# Altium schematic sheet ADF4351原理图(改).SchDoc
size C; Organization: Altium Limited; Address1: L3, 12a Rodborough Rd; Address2: Frenchs Forest; Address3: NSW; Address4: Australia 2086
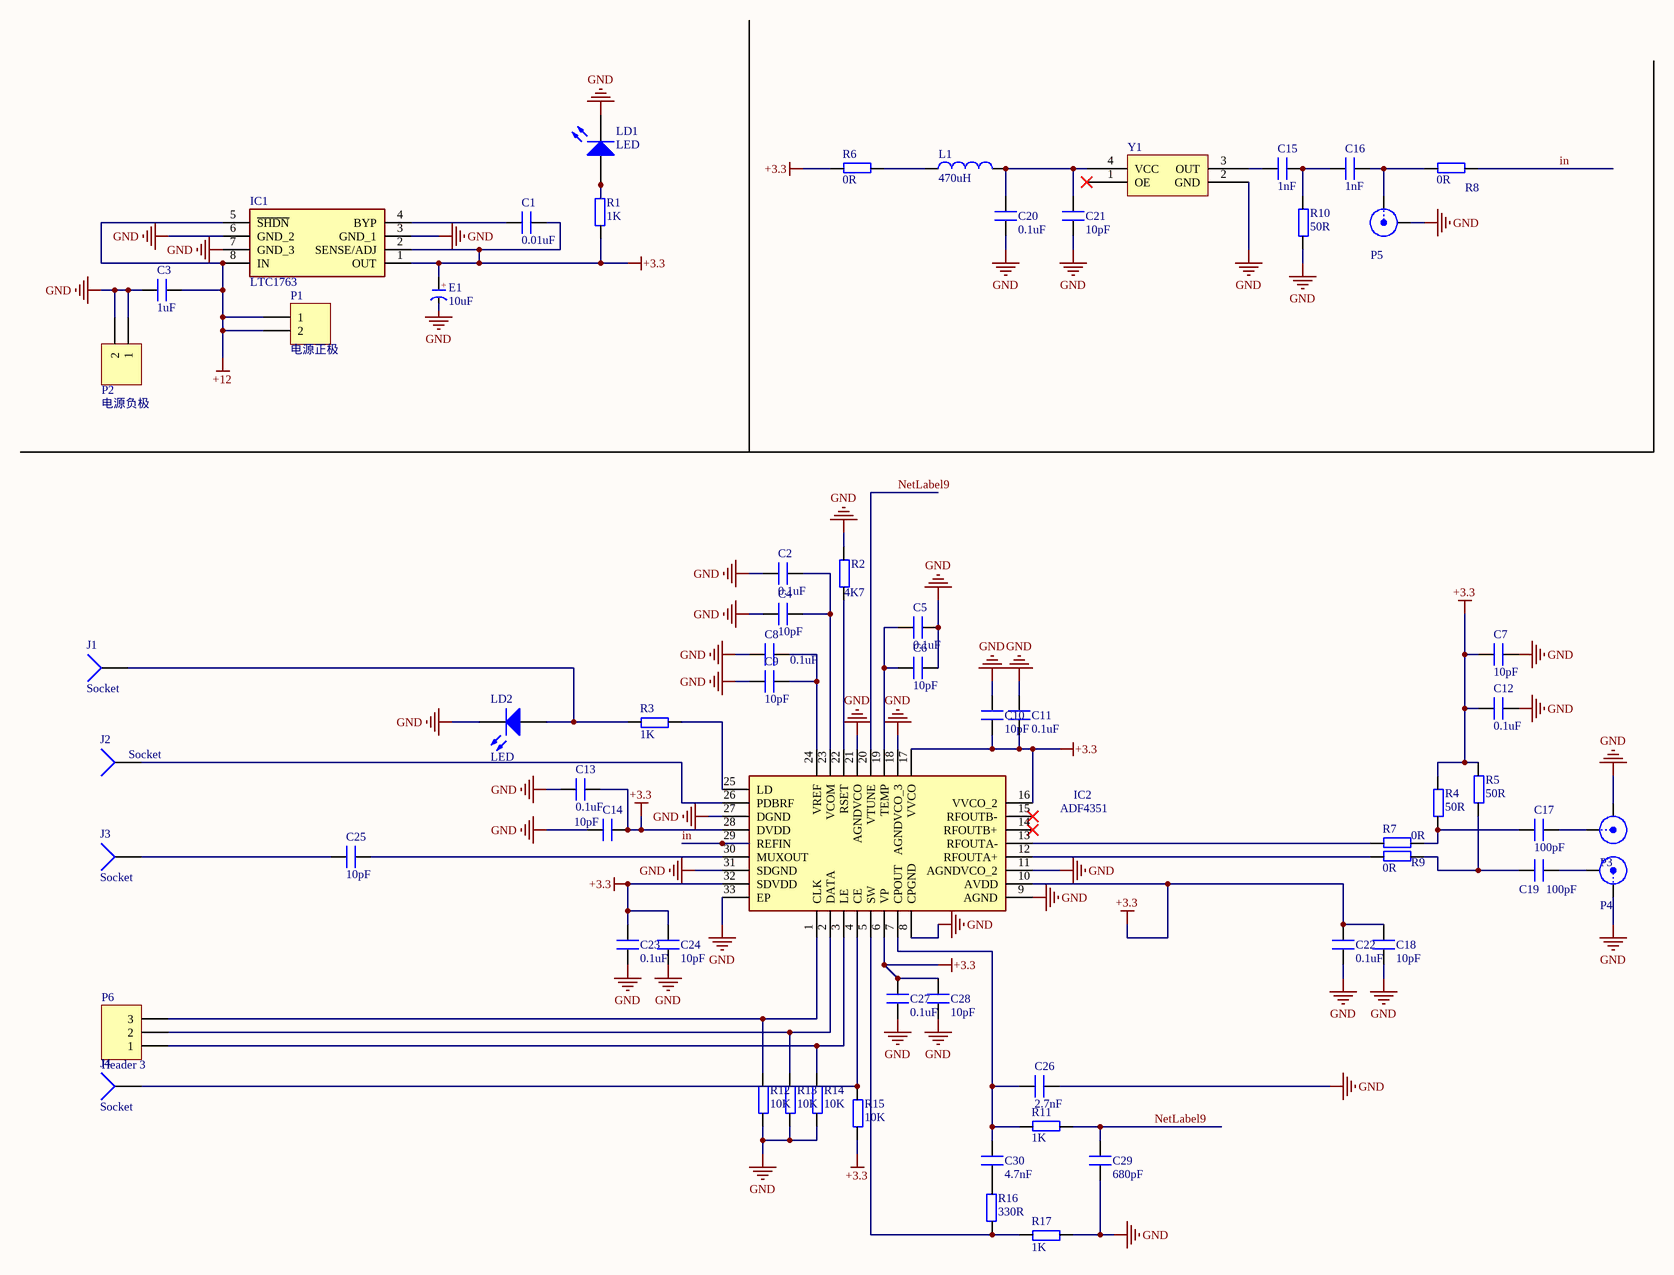
[diagram p0: ADF4351原理图(改).SchDoc]

## Parts
C1  0.01uF  [0603C]
C2  0.1uF  [0603C]
C3  1uF  [0603C]
C4  10pF  [0603C]
C5  0.1uF  [0603C]
C6  10pF  [0603C]
C7  10pF  [0603C]
C8  0.1uF  [0603C]
C9  10pF  [0603C]
C10  10pF  [0603C]
C11  0.1uF  [0603C]
C12  0.1uF  [0603C]
C13  0.1uF  [0603C]
C14  10pF  [0603C]
C15  1nF  [0603C]
C16  1nF  [0603C]
C17  100pF  [0603C]
C18  10pF  [0603C]
C19  100pF  [0603C]
C20  0.1uF  [0603C]
C21  10pF  [0603C]
C22  0.1uF  [0603C]
C23  0.1uF  [0603C]
C24  10pF  [0603C]
C25  10pF  [0603C]
C26  2.7nF  [0603C]
C27  0.1uF  [0603C]
C28  10pF  [0603C]
C29  680pF  [0603C]
C30  4.7nF  [0603C]
E1  10uF  [CAP 1.5*4*8]
IC1  LTC1763  [SOIC8_1R27_4R9X6]
IC2  ADF4351  [QFN50P500X500X100-33N]
J1  Socket  [PIN1]
J2  Socket  [PIN1]
J3  Socket  [PIN1]
J4  Socket  [PIN1]
L1  470uH  [0603C]
LD1  LED  [SMDLED]
LD2  LED  [SMDLED]
P1  电源正极  [HDR1X2]
P2  电源负极  [HDR1X2]
P3  SMA  [SMA-V]  (value not drawn)
P4  SMA  [SMA-V]  (value not drawn)
P5  SMA  [SMA-V]  (value not drawn)
P6  Header 3  [HDR1X3]
R1  1K  [RS 1/4W]
R2  4K7  [0603R]
R3  1K  [0603R]
R4  50R  [0603R]
R5  50R  [0603R]
R6  0R  [0603R]
R7  0R  [0603R]
R8  0R  [0603R]
R9  0R  [0603R]
R10  50R  [0603R]
R11  1K  [0603R]
R12  10K  [0603R]
R13  10K  [0603R]
R14  10K  [0603R]
R15  10K  [0603R]
R16  330R  [0603R]
R17  1K  [0603R]
Y1  (no value)  [XTAL-OCX7050]

## Nets
+3.3: C1.2 C7.1 C10.1 C11.1 C12.1 C13.1 C14.1 C18.1 C22.1 C23.1 C24.1 C27.1 C28.1 E1.1(A) IC1.1(OUT) IC1.2(SENSE/ADJ) IC2.6(VP) IC2.10(AVDD) IC2.16(VVCO_2) IC2.17(VVCO) IC2.28(DVDD) IC2.32(SDVDD) R1.2 R4.2 R5.2 R6.2 R15.1
+12: C3.2 IC1.5(~{SHDN}) IC1.8(IN) P1.1 P1.2
GND: C2.2 C3.1 C4.2 C5.1 C6.1 C7.2 C8.2 C9.2 C10.2 C11.2 C12.2 C13.2 C14.2 C18.2 C20.2 C21.2 C22.2 C23.2 C24.2 C26.2 C27.2 C28.2 C29.2 E1.2(K) IC1.3(GND_1) IC1.6(GND_2) IC1.7(GND_3) IC2.8(CPGND) IC2.9(AGND) IC2.11(AGNDVCO_2) IC2.18(AGNDVCO_3) IC2.21(AGNDVCO) IC2.27(DGND) IC2.31(SDGND) IC2.33(EP) LD1.2(K) LD2.2(K) P2.1 P2.2 P3.2(Y) P4.1(X) P5.2(Y) R2.2 R10.1 R12.1 R13.1 R14.1 R17.2 Y1.2(GND)
in: IC2.29(REFIN) R8.1
NetLabel9: C29.1 IC2.20(VTUNE) R11.1
NetC1_1: C1.1 IC1.4(BYP)
NetC2_1: C2.1 C4.1 IC2.23(VCOM)
NetC5_2: C5.2 C6.2 IC2.19(TEMP)
NetC8_1: C8.1 C9.1 IC2.24(VREF)
NetC15_1: C15.1 C16.2 R10.2
NetC15_2: C15.2 Y1.3(OUT)
NetC16_1: C16.1 P5.1(X) R8.2
NetC17_1: C17.1 R4.1 R7.1
NetC17_2: C17.2 P3.1(X)
NetC19_1: C19.1 R5.1 R9.1
NetC19_2: C19.2 P4.2(Y)
NetC20_1: C20.1 C21.1 L1.2 Y1.4(VCC)
NetC25_1: C25.1 J3.1
NetC25_2: C25.2 IC2.30(MUXOUT)
NetC26_1: C26.1 C30.2 IC2.7(CPOUT) R11.2
NetC30_1: C30.1 R16.1
NetIC2_1: IC2.1(CLK) P6.3 R12.2
NetIC2_2: IC2.2(DATA) P6.2 R13.2
NetIC2_3: IC2.3(LE) P6.1 R14.2
NetIC2_4: IC2.4(CE) J4.1 R15.2
NetIC2_5: IC2.5(SW) R16.2 R17.1
NetIC2_12: IC2.12(RFOUTA+) R9.2
NetIC2_13: IC2.13(RFOUTA-) R7.2
NetIC2_22: IC2.22(RSET) R2.1
NetIC2_25: IC2.25(LD) R3.2
NetIC2_26: IC2.26(PDBRF) J2.1
NetJ1_1: J1.1 LD2.1(A) R3.1
NetL1_1: L1.1 R6.1
NetLD1_1: LD1.1(A) R1.1

Not connected (* = marked no-connect by the designer): IC2 14(RFOUTB+)* 15(RFOUTB-)*; Y1 1(OE)*

## Notes on the sheet
- Title
- Size:
- Date:
- File:
- C
- Number:
- Time:
- Revision:
- Sheet
- of
- (in symbol C-CAP) +

## Library data of the parts
C1-C30 = C: Capacitor
E1 = C-CAP: 直插电解电容; 版权归属: 源创客; BOM名称: 直插电解电容; 学习资源: www.ooocke.com
IC1 = LTC1763CS8-3.3#TRPBF: Integrated Circuit; Manufacturer_Name: Analog Devices; Datasheet Link: https://datasheet.lcsc.com/szlcsc/2004261932_Analog-Devices-ADI-LTC1763CS8-3-3-TRPBF_C515997.pdf; Height: 1.752mm; Manufacturer_Part_Number: LTC1763CS8-3.3#TRPBF; Arrow Part Number: LTC1763CS8-3.3#TRPBF
IC2 = ADF4351BCPZ: Integrated Circuit; Manufacturer_Name: Analog Devices; Datasheet Link: https://componentsearchengine.com//ADF4351BCPZ.pdf; Mouser2 Part Number: 584-ADF4351BCPZ; Mouser2 Price/Stock: https://www.mouser.com/Search/Refine.aspx?Keyword=584-ADF4351BCPZ; Manufacturer_Part_Number: ADF4351BCPZ
L1 = Inductor: Value: 100uH; Published: 8-Jun-2000; Revision: July-2002: Re-released for DXP Platform.; Publisher: Altium Limited
LD1 LD2 = LED: Typical RED, GREEN, YELLOW, AMBER GaAs LED; Published: 8-Jun-2000; LatestRevisionDate: 17-Jul-2002; LatestRevisionNote: Re-released for DXP Platform.; PackageDocument: Feb-2002; PackageReference: 3.2X1.6X1.1; Publisher: Altium Limited
P1 P2 = Header 2: Header, 2-Pin; LatestRevisionDate: 17-Jul-2002; LatestRevisionNote: Re-released for DXP Platform.; Publisher: Altium Limited
P3-P5 = SMA: SMA Connector
P6 = Header 3: Header, 3-Pin; LatestRevisionDate: 17-Jul-2002; LatestRevisionNote: Re-released for DXP Platform.; Publisher: Altium Limited
R1-R17 = Resistor
Y1 = XTAL-SPXO: Simple Package Xtal Oscillator
J1-J4 = Socket: LatestRevisionDate: 17-Jul-2002; LatestRevisionNote: Re-released for DXP Platform.; Publisher: Altium Limited